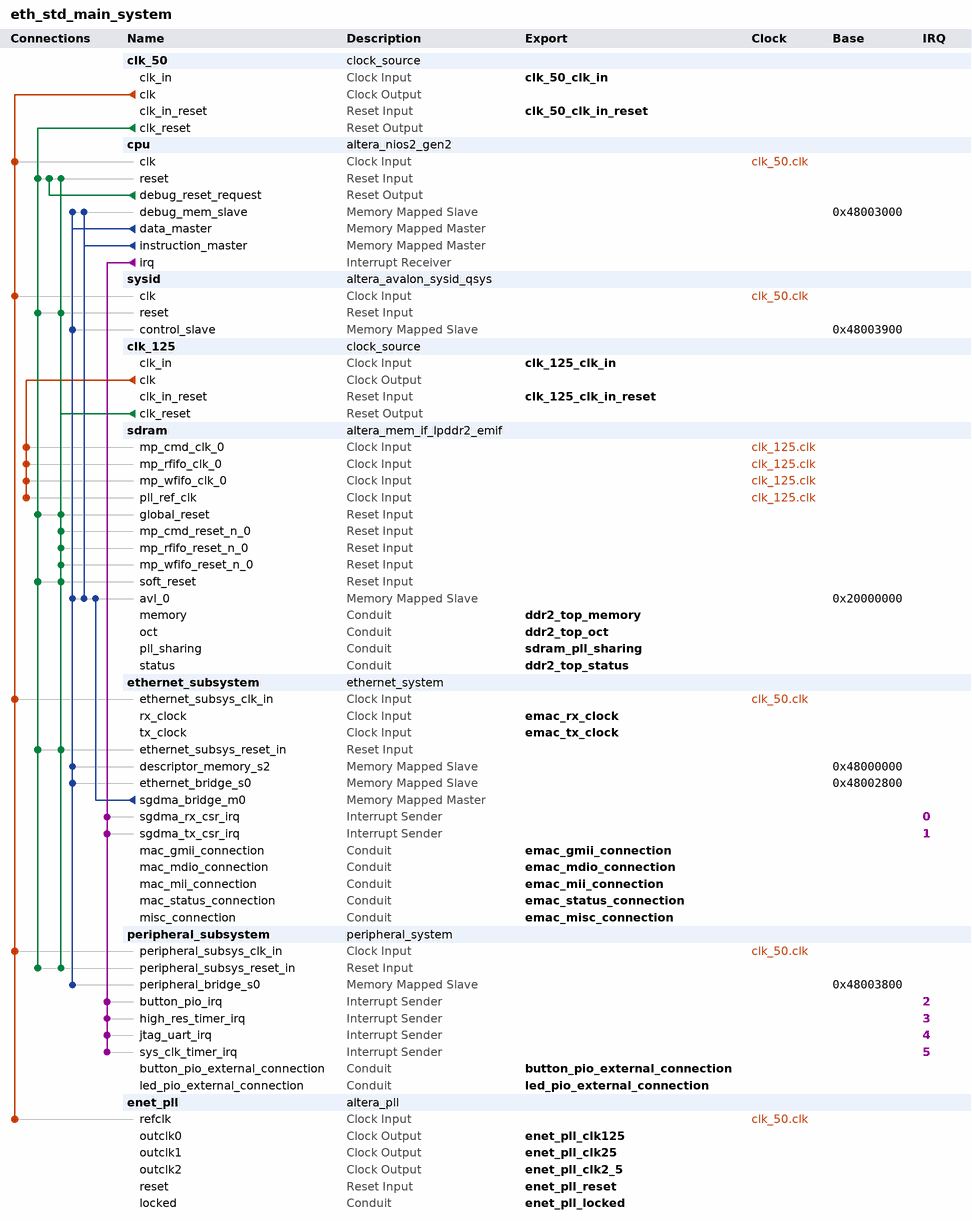
[diagram p0: system contents]
# Platform Designer (Qsys) system eth_std_main_system, Cyclone V 5CGXFC5C6F27C7
# Parameters at their usual value, and those the tool derives, are not listed.
package require -exact qsys 16.1
create_system eth_std_main_system
set_project_property DEVICE_FAMILY {Cyclone V}
set_project_property DEVICE 5CGXFC5C6F27C7

add_instance clk_50 clock_source 16.1
set_instance_parameter_value clk_50 clockFrequency 50000000

add_instance cpu altera_nios2_gen2 16.1
set_instance_parameter_value cpu dcache_size 2048
set_instance_parameter_value cpu exceptionOffset 288
set_instance_parameter_value cpu exceptionSlave sdram.avl_0
set_instance_parameter_value cpu icache_size 4096
set_instance_parameter_value cpu impl Fast
set_instance_parameter_value cpu resetSlave sdram.avl_0

add_instance sysid altera_avalon_sysid_qsys 16.1
set_instance_parameter_value sysid id 0

add_instance clk_125 clock_source 16.1
set_instance_parameter_value clk_125 clockFrequency 125000000

add_instance sdram altera_mem_if_lpddr2_emif 16.1
set_instance_parameter_value sdram ABSTRACT_REAL_COMPARE_TEST false
set_instance_parameter_value sdram ABS_RAM_MEM_INIT_FILENAME meminit
set_instance_parameter_value sdram ACV_PHY_CLK_ADD_FR_PHASE 0.0
set_instance_parameter_value sdram AC_PACKAGE_DESKEW false
set_instance_parameter_value sdram AC_ROM_USER_ADD_0 0_0000_0000_0000
set_instance_parameter_value sdram AC_ROM_USER_ADD_1 0_0000_0000_1000
set_instance_parameter_value sdram ADDR_ORDER 0
set_instance_parameter_value sdram ADD_EFFICIENCY_MONITOR false
set_instance_parameter_value sdram ADD_EXTERNAL_SEQ_DEBUG_NIOS false
set_instance_parameter_value sdram ADVANCED_CK_PHASES false
set_instance_parameter_value sdram ADVERTIZE_SEQUENCER_SW_BUILD_FILES false
set_instance_parameter_value sdram AFI_DEBUG_INFO_WIDTH 32
set_instance_parameter_value sdram ALTMEMPHY_COMPATIBLE_MODE false
set_instance_parameter_value sdram AP_MODE false
set_instance_parameter_value sdram AP_MODE_EN 0
set_instance_parameter_value sdram AVL_DATA_WIDTH_PORT 32,32,32,32,32,32
set_instance_parameter_value sdram AVL_MAX_SIZE 4
set_instance_parameter_value sdram BYTE_ENABLE true
set_instance_parameter_value sdram C2P_WRITE_CLOCK_ADD_PHASE 0.0
set_instance_parameter_value sdram CALIBRATION_MODE Skip
set_instance_parameter_value sdram CALIB_REG_WIDTH 8
set_instance_parameter_value sdram CFG_DATA_REORDERING_TYPE INTER_BANK
set_instance_parameter_value sdram CFG_REORDER_DATA true
set_instance_parameter_value sdram CFG_TCCD_NS 2.5
set_instance_parameter_value sdram COMMAND_PHASE 0.0
set_instance_parameter_value sdram CONTROLLER_LATENCY 5
set_instance_parameter_value sdram CORE_DEBUG_CONNECTION EXPORT
set_instance_parameter_value sdram CPORT_TYPE_PORT Bidirectional,Bidirectional,Bidirectional,Bidirectional,Bidirectional,Bidirectional
set_instance_parameter_value sdram CTL_AUTOPCH_EN false
set_instance_parameter_value sdram CTL_CMD_QUEUE_DEPTH 8
set_instance_parameter_value sdram CTL_CSR_CONNECTION INTERNAL_JTAG
set_instance_parameter_value sdram CTL_CSR_ENABLED false
set_instance_parameter_value sdram CTL_CSR_READ_ONLY 1
set_instance_parameter_value sdram CTL_DEEP_POWERDN_EN false
set_instance_parameter_value sdram CTL_DYNAMIC_BANK_ALLOCATION false
set_instance_parameter_value sdram CTL_DYNAMIC_BANK_NUM 4
set_instance_parameter_value sdram CTL_ECC_AUTO_CORRECTION_ENABLED false
set_instance_parameter_value sdram CTL_ECC_ENABLED false
set_instance_parameter_value sdram CTL_ENABLE_BURST_INTERRUPT false
set_instance_parameter_value sdram CTL_ENABLE_BURST_TERMINATE false
set_instance_parameter_value sdram CTL_HRB_ENABLED false
set_instance_parameter_value sdram CTL_LOOK_AHEAD_DEPTH 4
set_instance_parameter_value sdram CTL_SELF_REFRESH_EN false
set_instance_parameter_value sdram CTL_USR_REFRESH_EN false
set_instance_parameter_value sdram CTL_ZQCAL_EN false
set_instance_parameter_value sdram CUT_NEW_FAMILY_TIMING true
set_instance_parameter_value sdram DAT_DATA_WIDTH 32
set_instance_parameter_value sdram DEBUG_MODE false
set_instance_parameter_value sdram DEVICE_DEPTH 1
set_instance_parameter_value sdram DISABLE_CHILD_MESSAGING false
set_instance_parameter_value sdram DISCRETE_FLY_BY true
set_instance_parameter_value sdram DLL_SHARING_MODE None
set_instance_parameter_value sdram DQS_DQSN_MODE DIFFERENTIAL
set_instance_parameter_value sdram DQ_INPUT_REG_USE_CLKN false
set_instance_parameter_value sdram DUPLICATE_AC false
set_instance_parameter_value sdram ED_EXPORT_SEQ_DEBUG false
set_instance_parameter_value sdram ENABLE_ABS_RAM_MEM_INIT false
set_instance_parameter_value sdram ENABLE_BONDING false
set_instance_parameter_value sdram ENABLE_BURST_MERGE false
set_instance_parameter_value sdram ENABLE_CTRL_AVALON_INTERFACE true
set_instance_parameter_value sdram ENABLE_DELAY_CHAIN_WRITE false
set_instance_parameter_value sdram ENABLE_EMIT_BFM_MASTER false
set_instance_parameter_value sdram ENABLE_EXPORT_SEQ_DEBUG_BRIDGE false
set_instance_parameter_value sdram ENABLE_EXTRA_REPORTING false
set_instance_parameter_value sdram ENABLE_ISS_PROBES false
set_instance_parameter_value sdram ENABLE_NON_DESTRUCTIVE_CALIB false
set_instance_parameter_value sdram ENABLE_NON_DES_CAL false
set_instance_parameter_value sdram ENABLE_NON_DES_CAL_TEST false
set_instance_parameter_value sdram ENABLE_SEQUENCER_MARGINING_ON_BY_DEFAULT false
set_instance_parameter_value sdram ENABLE_USER_ECC false
set_instance_parameter_value sdram EXPORT_AFI_HALF_CLK false
set_instance_parameter_value sdram FIX_READ_LATENCY 8
set_instance_parameter_value sdram FORCED_NON_LDC_ADDR_CMD_MEM_CK_INVERT false
set_instance_parameter_value sdram FORCED_NUM_WRITE_FR_CYCLE_SHIFTS 0
set_instance_parameter_value sdram FORCE_DQS_TRACKING AUTO
set_instance_parameter_value sdram FORCE_MAX_LATENCY_COUNT_WIDTH 0
set_instance_parameter_value sdram FORCE_SEQUENCER_TCL_DEBUG_MODE false
set_instance_parameter_value sdram FORCE_SHADOW_REGS AUTO
set_instance_parameter_value sdram HARD_EMIF true
set_instance_parameter_value sdram HCX_COMPAT_MODE false
set_instance_parameter_value sdram HHP_HPS false
set_instance_parameter_value sdram HHP_HPS_SIMULATION false
set_instance_parameter_value sdram HHP_HPS_VERIFICATION false
set_instance_parameter_value sdram HPS_PROTOCOL DEFAULT
set_instance_parameter_value sdram INCLUDE_BOARD_DELAY_MODEL false
set_instance_parameter_value sdram INCLUDE_MULTIRANK_BOARD_DELAY_MODEL false
set_instance_parameter_value sdram IS_ES_DEVICE false
set_instance_parameter_value sdram LOCAL_ID_WIDTH 8
set_instance_parameter_value sdram MARGIN_VARIATION_TEST false
set_instance_parameter_value sdram MAX_PENDING_RD_CMD 32
set_instance_parameter_value sdram MAX_PENDING_WR_CMD 16
set_instance_parameter_value sdram MEM_ATCL 0
set_instance_parameter_value sdram MEM_AUTO_LEVELING_MODE true
set_instance_parameter_value sdram MEM_BANKADDR_WIDTH 3
set_instance_parameter_value sdram MEM_BL 8
set_instance_parameter_value sdram MEM_BT Sequential
set_instance_parameter_value sdram MEM_CK_PHASE 0.0
set_instance_parameter_value sdram MEM_CK_WIDTH 1
set_instance_parameter_value sdram MEM_CLK_EN_WIDTH 1
set_instance_parameter_value sdram MEM_CLK_FREQ 330.0
set_instance_parameter_value sdram MEM_CLK_FREQ_MAX 400.0
set_instance_parameter_value sdram MEM_COL_ADDR_WIDTH 10
set_instance_parameter_value sdram MEM_CS_WIDTH 1
set_instance_parameter_value sdram MEM_DEVICE MISSING_MODEL
set_instance_parameter_value sdram MEM_DLL_EN true
set_instance_parameter_value sdram MEM_DQ_PER_DQS 8
set_instance_parameter_value sdram MEM_DQ_WIDTH 32
set_instance_parameter_value sdram MEM_DRV_STR 40
set_instance_parameter_value sdram MEM_FORMAT DISCRETE
set_instance_parameter_value sdram MEM_GUARANTEED_WRITE_INIT false
set_instance_parameter_value sdram MEM_IF_BOARD_BASE_DELAY 10
set_instance_parameter_value sdram MEM_IF_DM_PINS_EN true
set_instance_parameter_value sdram MEM_IF_DQSN_EN true
set_instance_parameter_value sdram MEM_IF_SIM_VALID_WINDOW 0
set_instance_parameter_value sdram MEM_INIT_EN false
set_instance_parameter_value sdram MEM_MIRROR_ADDRESSING 0
set_instance_parameter_value sdram MEM_NUMBER_OF_DIMMS 1
set_instance_parameter_value sdram MEM_NUMBER_OF_RANKS_PER_DEVICE 1
set_instance_parameter_value sdram MEM_NUMBER_OF_RANKS_PER_DIMM 1
set_instance_parameter_value sdram MEM_RANK_MULTIPLICATION_FACTOR 1
set_instance_parameter_value sdram MEM_ROW_ADDR_WIDTH 14
set_instance_parameter_value sdram MEM_TCL 7
set_instance_parameter_value sdram MEM_TFAW_NS 50.0
set_instance_parameter_value sdram MEM_TINIT_US 200
set_instance_parameter_value sdram MEM_TMRD_CK 2
set_instance_parameter_value sdram MEM_TRAS_NS 70.0
set_instance_parameter_value sdram MEM_TRCD_NS 18.0
set_instance_parameter_value sdram MEM_TREFI_US 3.9
set_instance_parameter_value sdram MEM_TRFC_NS 60.0
set_instance_parameter_value sdram MEM_TRP_NS 18.0
set_instance_parameter_value sdram MEM_TRRD_NS 10.0
set_instance_parameter_value sdram MEM_TRTP_NS 7.5
set_instance_parameter_value sdram MEM_TWR_NS 15.0
set_instance_parameter_value sdram MEM_TWTR 2
set_instance_parameter_value sdram MEM_USER_LEVELING_MODE Leveling
set_instance_parameter_value sdram MEM_VENDOR JEDEC
set_instance_parameter_value sdram MEM_VERBOSE true
set_instance_parameter_value sdram MRS_MIRROR_PING_PONG_ATSO false
set_instance_parameter_value sdram MULTICAST_EN false
set_instance_parameter_value sdram NEXTGEN true
set_instance_parameter_value sdram NIOS_ROM_DATA_WIDTH 32
set_instance_parameter_value sdram NUM_DLL_SHARING_INTERFACES 1
set_instance_parameter_value sdram NUM_EXTRA_REPORT_PATH 10
set_instance_parameter_value sdram NUM_OCT_SHARING_INTERFACES 1
set_instance_parameter_value sdram NUM_OF_PORTS 1
set_instance_parameter_value sdram NUM_PLL_SHARING_INTERFACES 1
set_instance_parameter_value sdram OCT_SHARING_MODE None
set_instance_parameter_value sdram P2C_READ_CLOCK_ADD_PHASE 0.0
set_instance_parameter_value sdram PACKAGE_DESKEW false
set_instance_parameter_value sdram PARSE_FRIENDLY_DEVICE_FAMILY_PARAM_VALID false
set_instance_parameter_value sdram PHY_CSR_CONNECTION INTERNAL_JTAG
set_instance_parameter_value sdram PHY_CSR_ENABLED false
set_instance_parameter_value sdram PHY_ONLY false
set_instance_parameter_value sdram PINGPONGPHY_EN false
set_instance_parameter_value sdram PLL_ADDR_CMD_CLK_DIV_PARAM 0
set_instance_parameter_value sdram PLL_ADDR_CMD_CLK_FREQ_PARAM 0.0
set_instance_parameter_value sdram PLL_ADDR_CMD_CLK_MULT_PARAM 0
set_instance_parameter_value sdram PLL_ADDR_CMD_CLK_PHASE_PS_PARAM 0
set_instance_parameter_value sdram PLL_AFI_CLK_DIV_PARAM 0
set_instance_parameter_value sdram PLL_AFI_CLK_FREQ_PARAM 0.0
set_instance_parameter_value sdram PLL_AFI_CLK_MULT_PARAM 0
set_instance_parameter_value sdram PLL_AFI_CLK_PHASE_PS_PARAM 0
set_instance_parameter_value sdram PLL_AFI_HALF_CLK_DIV_PARAM 0
set_instance_parameter_value sdram PLL_AFI_HALF_CLK_FREQ_PARAM 0.0
set_instance_parameter_value sdram PLL_AFI_HALF_CLK_MULT_PARAM 0
set_instance_parameter_value sdram PLL_AFI_HALF_CLK_PHASE_PS_PARAM 0
set_instance_parameter_value sdram PLL_AFI_PHY_CLK_DIV_PARAM 0
set_instance_parameter_value sdram PLL_AFI_PHY_CLK_FREQ_PARAM 0.0
set_instance_parameter_value sdram PLL_AFI_PHY_CLK_MULT_PARAM 0
set_instance_parameter_value sdram PLL_AFI_PHY_CLK_PHASE_PS_PARAM 0
set_instance_parameter_value sdram PLL_C2P_WRITE_CLK_DIV_PARAM 0
set_instance_parameter_value sdram PLL_C2P_WRITE_CLK_FREQ_PARAM 0.0
set_instance_parameter_value sdram PLL_C2P_WRITE_CLK_MULT_PARAM 0
set_instance_parameter_value sdram PLL_C2P_WRITE_CLK_PHASE_PS_PARAM 0
set_instance_parameter_value sdram PLL_CLK_PARAM_VALID false
set_instance_parameter_value sdram PLL_CONFIG_CLK_DIV_PARAM 0
set_instance_parameter_value sdram PLL_CONFIG_CLK_FREQ_PARAM 0.0
set_instance_parameter_value sdram PLL_CONFIG_CLK_MULT_PARAM 0
set_instance_parameter_value sdram PLL_CONFIG_CLK_PHASE_PS_PARAM 0
set_instance_parameter_value sdram PLL_DR_CLK_DIV_PARAM 0
set_instance_parameter_value sdram PLL_DR_CLK_FREQ_PARAM 0.0
set_instance_parameter_value sdram PLL_DR_CLK_MULT_PARAM 0
set_instance_parameter_value sdram PLL_DR_CLK_PHASE_PS_PARAM 0
set_instance_parameter_value sdram PLL_HR_CLK_DIV_PARAM 0
set_instance_parameter_value sdram PLL_HR_CLK_FREQ_PARAM 0.0
set_instance_parameter_value sdram PLL_HR_CLK_MULT_PARAM 0
set_instance_parameter_value sdram PLL_HR_CLK_PHASE_PS_PARAM 0
set_instance_parameter_value sdram PLL_LOCATION Top_Bottom
set_instance_parameter_value sdram PLL_MEM_CLK_DIV_PARAM 0
set_instance_parameter_value sdram PLL_MEM_CLK_FREQ_PARAM 0.0
set_instance_parameter_value sdram PLL_MEM_CLK_MULT_PARAM 0
set_instance_parameter_value sdram PLL_MEM_CLK_PHASE_PS_PARAM 0
set_instance_parameter_value sdram PLL_NIOS_CLK_DIV_PARAM 0
set_instance_parameter_value sdram PLL_NIOS_CLK_FREQ_PARAM 0.0
set_instance_parameter_value sdram PLL_NIOS_CLK_MULT_PARAM 0
set_instance_parameter_value sdram PLL_NIOS_CLK_PHASE_PS_PARAM 0
set_instance_parameter_value sdram PLL_P2C_READ_CLK_DIV_PARAM 0
set_instance_parameter_value sdram PLL_P2C_READ_CLK_FREQ_PARAM 0.0
set_instance_parameter_value sdram PLL_P2C_READ_CLK_MULT_PARAM 0
set_instance_parameter_value sdram PLL_P2C_READ_CLK_PHASE_PS_PARAM 0
set_instance_parameter_value sdram PLL_SHARING_MODE None
set_instance_parameter_value sdram PLL_WRITE_CLK_DIV_PARAM 0
set_instance_parameter_value sdram PLL_WRITE_CLK_FREQ_PARAM 0.0
set_instance_parameter_value sdram PLL_WRITE_CLK_MULT_PARAM 0
set_instance_parameter_value sdram PLL_WRITE_CLK_PHASE_PS_PARAM 0
set_instance_parameter_value sdram POWER_OF_TWO_BUS false
set_instance_parameter_value sdram PRIORITY_PORT 1,1,1,1,1,1
set_instance_parameter_value sdram RATE Full
set_instance_parameter_value sdram READ_DQ_DQS_CLOCK_SOURCE INVERTED_DQS_BUS
set_instance_parameter_value sdram READ_FIFO_SIZE 8
set_instance_parameter_value sdram REFRESH_BURST_VALIDATION false
set_instance_parameter_value sdram REFRESH_INTERVAL 15000
set_instance_parameter_value sdram REF_CLK_FREQ 100.0
set_instance_parameter_value sdram REF_CLK_FREQ_MAX_PARAM 0.0
set_instance_parameter_value sdram REF_CLK_FREQ_MIN_PARAM 0.0
set_instance_parameter_value sdram REF_CLK_FREQ_PARAM_VALID false
set_instance_parameter_value sdram SEQUENCER_TYPE NIOS
set_instance_parameter_value sdram SEQ_MODE 0
set_instance_parameter_value sdram SKIP_MEM_INIT true
set_instance_parameter_value sdram SOPC_COMPAT_RESET false
set_instance_parameter_value sdram SPEED_GRADE 7
set_instance_parameter_value sdram STARVE_LIMIT 10
set_instance_parameter_value sdram TIMING_BOARD_AC_EYE_REDUCTION_H 0.0
set_instance_parameter_value sdram TIMING_BOARD_AC_EYE_REDUCTION_SU 0.0
set_instance_parameter_value sdram TIMING_BOARD_AC_SKEW 0.02
set_instance_parameter_value sdram TIMING_BOARD_AC_SLEW_RATE 1.0
set_instance_parameter_value sdram TIMING_BOARD_AC_TO_CK_SKEW 0.0
set_instance_parameter_value sdram TIMING_BOARD_CK_CKN_SLEW_RATE 2.0
set_instance_parameter_value sdram TIMING_BOARD_DELTA_DQS_ARRIVAL_TIME 0.0
set_instance_parameter_value sdram TIMING_BOARD_DELTA_READ_DQS_ARRIVAL_TIME 0.0
set_instance_parameter_value sdram TIMING_BOARD_DERATE_METHOD AUTO
set_instance_parameter_value sdram TIMING_BOARD_DQS_DQSN_SLEW_RATE 2.0
set_instance_parameter_value sdram TIMING_BOARD_DQ_EYE_REDUCTION 0.0
set_instance_parameter_value sdram TIMING_BOARD_DQ_SLEW_RATE 1.0
set_instance_parameter_value sdram TIMING_BOARD_DQ_TO_DQS_SKEW 0.0
set_instance_parameter_value sdram TIMING_BOARD_ISI_METHOD AUTO
set_instance_parameter_value sdram TIMING_BOARD_MAX_CK_DELAY 0.33
set_instance_parameter_value sdram TIMING_BOARD_MAX_DQS_DELAY 0.34
set_instance_parameter_value sdram TIMING_BOARD_READ_DQ_EYE_REDUCTION 0.0
set_instance_parameter_value sdram TIMING_BOARD_SKEW_BETWEEN_DIMMS 0.05
set_instance_parameter_value sdram TIMING_BOARD_SKEW_BETWEEN_DQS 0.02
set_instance_parameter_value sdram TIMING_BOARD_SKEW_CKDQS_DIMM_MAX 0.01
set_instance_parameter_value sdram TIMING_BOARD_SKEW_CKDQS_DIMM_MIN -0.01
set_instance_parameter_value sdram TIMING_BOARD_SKEW_WITHIN_DQS 0.02
set_instance_parameter_value sdram TIMING_BOARD_TDH 0.0
set_instance_parameter_value sdram TIMING_BOARD_TDS 0.0
set_instance_parameter_value sdram TIMING_BOARD_TIH 0.0
set_instance_parameter_value sdram TIMING_BOARD_TIS 0.0
set_instance_parameter_value sdram TIMING_TDH 270
set_instance_parameter_value sdram TIMING_TDQSCK 5500
set_instance_parameter_value sdram TIMING_TDQSCKDL 1200
set_instance_parameter_value sdram TIMING_TDQSCKDM 900
set_instance_parameter_value sdram TIMING_TDQSCKDS 450
set_instance_parameter_value sdram TIMING_TDQSH 0.4
set_instance_parameter_value sdram TIMING_TDQSQ 240
set_instance_parameter_value sdram TIMING_TDQSS 1.0
set_instance_parameter_value sdram TIMING_TDS 270
set_instance_parameter_value sdram TIMING_TDSH 0.2
set_instance_parameter_value sdram TIMING_TDSS 0.2
set_instance_parameter_value sdram TIMING_TIH 290
set_instance_parameter_value sdram TIMING_TIS 290
set_instance_parameter_value sdram TIMING_TQHS 280
set_instance_parameter_value sdram TRACKING_ERROR_TEST false
set_instance_parameter_value sdram TRACKING_WATCH_TEST false
set_instance_parameter_value sdram TREFI 35100
set_instance_parameter_value sdram TRFC 350
set_instance_parameter_value sdram USER_DEBUG_LEVEL 1
set_instance_parameter_value sdram USE_AXI_ADAPTOR false
set_instance_parameter_value sdram USE_FAKE_PHY false
set_instance_parameter_value sdram USE_MEM_CLK_FREQ false
set_instance_parameter_value sdram USE_MM_ADAPTOR true
set_instance_parameter_value sdram USE_SEQUENCER_BFM false
set_instance_parameter_value sdram WEIGHT_PORT 0,0,0,0,0,0
set_instance_parameter_value sdram WRBUFFER_ADDR_WIDTH 6

add_instance ethernet_subsystem ethernet_system 1.0

add_instance peripheral_subsystem peripheral_system 1.0

add_instance enet_pll altera_pll 16.1
set_instance_parameter_value enet_pll gui_device_speed_grade 1
set_instance_parameter_value enet_pll gui_number_of_clocks 3
set_instance_parameter_value enet_pll gui_operation_mode normal
set_instance_parameter_value enet_pll gui_output_clock_frequency0 125.0
set_instance_parameter_value enet_pll gui_output_clock_frequency1 25.0
set_instance_parameter_value enet_pll gui_output_clock_frequency2 2.5
set_instance_parameter_value enet_pll gui_pll_mode {Integer-N PLL}
set_instance_parameter_value enet_pll gui_reference_clock_frequency 50.0
set_instance_parameter_value enet_pll gui_use_locked true

# connections
add_connection clk_50.clk cpu.clk clock
add_connection clk_50.clk enet_pll.refclk clock
add_connection clk_50.clk ethernet_subsystem.ethernet_subsys_clk_in clock
add_connection clk_50.clk peripheral_subsystem.peripheral_subsys_clk_in clock
add_connection clk_50.clk sysid.clk clock
add_connection clk_125.clk sdram.mp_cmd_clk_0 clock
add_connection clk_125.clk sdram.mp_rfifo_clk_0 clock
add_connection clk_125.clk sdram.mp_wfifo_clk_0 clock
add_connection clk_125.clk sdram.pll_ref_clk clock
add_connection clk_50.clk_reset cpu.reset reset
add_connection clk_50.clk_reset ethernet_subsystem.ethernet_subsys_reset_in reset
add_connection clk_50.clk_reset peripheral_subsystem.peripheral_subsys_reset_in reset
add_connection clk_50.clk_reset sdram.global_reset reset
add_connection clk_50.clk_reset sdram.soft_reset reset
add_connection clk_50.clk_reset sysid.reset reset
add_connection clk_125.clk_reset cpu.reset reset
add_connection clk_125.clk_reset ethernet_subsystem.ethernet_subsys_reset_in reset
add_connection clk_125.clk_reset peripheral_subsystem.peripheral_subsys_reset_in reset
add_connection clk_125.clk_reset sdram.global_reset reset
add_connection clk_125.clk_reset sdram.mp_cmd_reset_n_0 reset
add_connection clk_125.clk_reset sdram.mp_rfifo_reset_n_0 reset
add_connection clk_125.clk_reset sdram.mp_wfifo_reset_n_0 reset
add_connection clk_125.clk_reset sdram.soft_reset reset
add_connection clk_125.clk_reset sysid.reset reset
add_connection cpu.debug_reset_request cpu.reset reset
add_connection cpu.data_master cpu.debug_mem_slave avalon
set_connection_parameter_value cpu.data_master/cpu.debug_mem_slave baseAddress 0x48003000
add_connection cpu.data_master ethernet_subsystem.descriptor_memory_s2 avalon
set_connection_parameter_value cpu.data_master/ethernet_subsystem.descriptor_memory_s2 baseAddress 0x48000000
add_connection cpu.data_master ethernet_subsystem.ethernet_bridge_s0 avalon
set_connection_parameter_value cpu.data_master/ethernet_subsystem.ethernet_bridge_s0 baseAddress 0x48002800
add_connection cpu.data_master peripheral_subsystem.peripheral_bridge_s0 avalon
set_connection_parameter_value cpu.data_master/peripheral_subsystem.peripheral_bridge_s0 baseAddress 0x48003800
add_connection cpu.data_master sdram.avl_0 avalon
set_connection_parameter_value cpu.data_master/sdram.avl_0 baseAddress 0x20000000
add_connection cpu.data_master sysid.control_slave avalon
set_connection_parameter_value cpu.data_master/sysid.control_slave baseAddress 0x48003900
add_connection cpu.instruction_master cpu.debug_mem_slave avalon
set_connection_parameter_value cpu.instruction_master/cpu.debug_mem_slave baseAddress 0x48003000
add_connection cpu.instruction_master sdram.avl_0 avalon
set_connection_parameter_value cpu.instruction_master/sdram.avl_0 baseAddress 0x20000000
add_connection ethernet_subsystem.sgdma_bridge_m0 sdram.avl_0 avalon
set_connection_parameter_value ethernet_subsystem.sgdma_bridge_m0/sdram.avl_0 baseAddress 0x20000000
add_connection cpu.irq ethernet_subsystem.sgdma_rx_csr_irq interrupt
set_connection_parameter_value cpu.irq/ethernet_subsystem.sgdma_rx_csr_irq irqNumber 0
add_connection cpu.irq ethernet_subsystem.sgdma_tx_csr_irq interrupt
set_connection_parameter_value cpu.irq/ethernet_subsystem.sgdma_tx_csr_irq irqNumber 1
add_connection cpu.irq peripheral_subsystem.button_pio_irq interrupt
set_connection_parameter_value cpu.irq/peripheral_subsystem.button_pio_irq irqNumber 2
add_connection cpu.irq peripheral_subsystem.high_res_timer_irq interrupt
set_connection_parameter_value cpu.irq/peripheral_subsystem.high_res_timer_irq irqNumber 3
add_connection cpu.irq peripheral_subsystem.jtag_uart_irq interrupt
set_connection_parameter_value cpu.irq/peripheral_subsystem.jtag_uart_irq irqNumber 4
add_connection cpu.irq peripheral_subsystem.sys_clk_timer_irq interrupt
set_connection_parameter_value cpu.irq/peripheral_subsystem.sys_clk_timer_irq irqNumber 5

# exported interfaces
add_interface button_pio_external_connection conduit end
set_interface_property button_pio_external_connection EXPORT_OF peripheral_subsystem.button_pio_external_connection
add_interface clk_125_clk_in clock sink
set_interface_property clk_125_clk_in EXPORT_OF clk_125.clk_in
add_interface clk_125_clk_in_reset reset sink
set_interface_property clk_125_clk_in_reset EXPORT_OF clk_125.clk_in_reset
add_interface clk_50_clk_in clock sink
set_interface_property clk_50_clk_in EXPORT_OF clk_50.clk_in
add_interface clk_50_clk_in_reset reset sink
set_interface_property clk_50_clk_in_reset EXPORT_OF clk_50.clk_in_reset
add_interface ddr2_top_memory conduit end
set_interface_property ddr2_top_memory EXPORT_OF sdram.memory
add_interface ddr2_top_oct conduit end
set_interface_property ddr2_top_oct EXPORT_OF sdram.oct
add_interface ddr2_top_status conduit end
set_interface_property ddr2_top_status EXPORT_OF sdram.status
add_interface emac_gmii_connection conduit end
set_interface_property emac_gmii_connection EXPORT_OF ethernet_subsystem.mac_gmii_connection
add_interface emac_mdio_connection conduit end
set_interface_property emac_mdio_connection EXPORT_OF ethernet_subsystem.mac_mdio_connection
add_interface emac_mii_connection conduit end
set_interface_property emac_mii_connection EXPORT_OF ethernet_subsystem.mac_mii_connection
add_interface emac_misc_connection conduit end
set_interface_property emac_misc_connection EXPORT_OF ethernet_subsystem.misc_connection
add_interface emac_rx_clock clock sink
set_interface_property emac_rx_clock EXPORT_OF ethernet_subsystem.rx_clock
add_interface emac_status_connection conduit end
set_interface_property emac_status_connection EXPORT_OF ethernet_subsystem.mac_status_connection
add_interface emac_tx_clock clock sink
set_interface_property emac_tx_clock EXPORT_OF ethernet_subsystem.tx_clock
add_interface enet_pll_clk125 clock source
set_interface_property enet_pll_clk125 EXPORT_OF enet_pll.outclk0
add_interface enet_pll_clk25 clock source
set_interface_property enet_pll_clk25 EXPORT_OF enet_pll.outclk1
add_interface enet_pll_clk2_5 clock source
set_interface_property enet_pll_clk2_5 EXPORT_OF enet_pll.outclk2
add_interface enet_pll_locked conduit end
set_interface_property enet_pll_locked EXPORT_OF enet_pll.locked
add_interface enet_pll_reset reset sink
set_interface_property enet_pll_reset EXPORT_OF enet_pll.reset
add_interface led_pio_external_connection conduit end
set_interface_property led_pio_external_connection EXPORT_OF peripheral_subsystem.led_pio_external_connection
add_interface sdram_pll_sharing conduit end
set_interface_property sdram_pll_sharing EXPORT_OF sdram.pll_sharing

set_interconnect_requirement {$system} qsys_mm.clockCrossingAdapter HANDSHAKE
set_interconnect_requirement {$system} qsys_mm.enableEccProtection FALSE
set_interconnect_requirement {$system} qsys_mm.insertDefaultSlave FALSE
set_interconnect_requirement {$system} qsys_mm.maxAdditionalLatency 1

save_system eth_std_main_system.qsys
